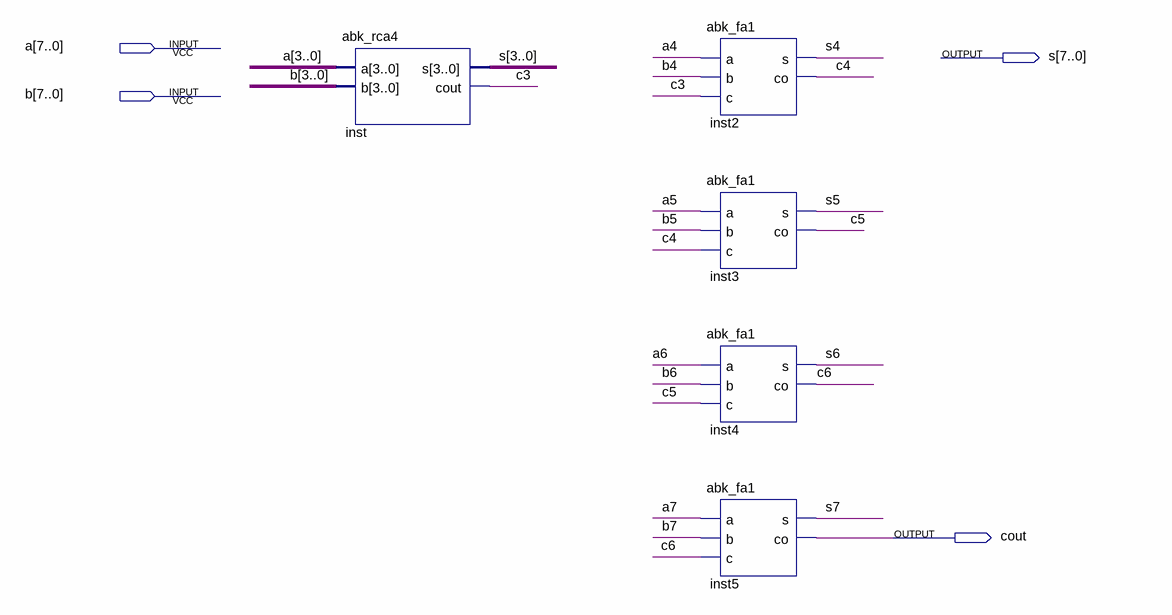
[diagram p0: schematic sheet]
// Quartus schematic abk_rca8.bdf as structural Verilog: 5 symbols, 4 pins
module abk_rca8 (
  input  [7:0] a,
  input  [7:0] b,
  output [7:0] s,
  output cout
);

  wire c3, c4, c5, c6;

  abk_rca4 inst (.a(a[3:0]), .b(b[3:0]), .s(s[3:0]), .cout(c3));
  abk_fa1 inst2 (.a(a[4]), .b(b[4]), .c(c3), .s(s[4]), .co(c4));
  abk_fa1 inst3 (.a(a[5]), .b(b[5]), .c(c4), .s(s[5]), .co(c5));
  abk_fa1 inst4 (.a(a[6]), .b(b[6]), .c(c5), .s(s[6]), .co(c6));
  abk_fa1 inst5 (.a(a[7]), .b(b[7]), .c(c6), .s(s[7]), .co(cout));
endmodule
